# EAGLE design Section (EAGLE 7.6.0)
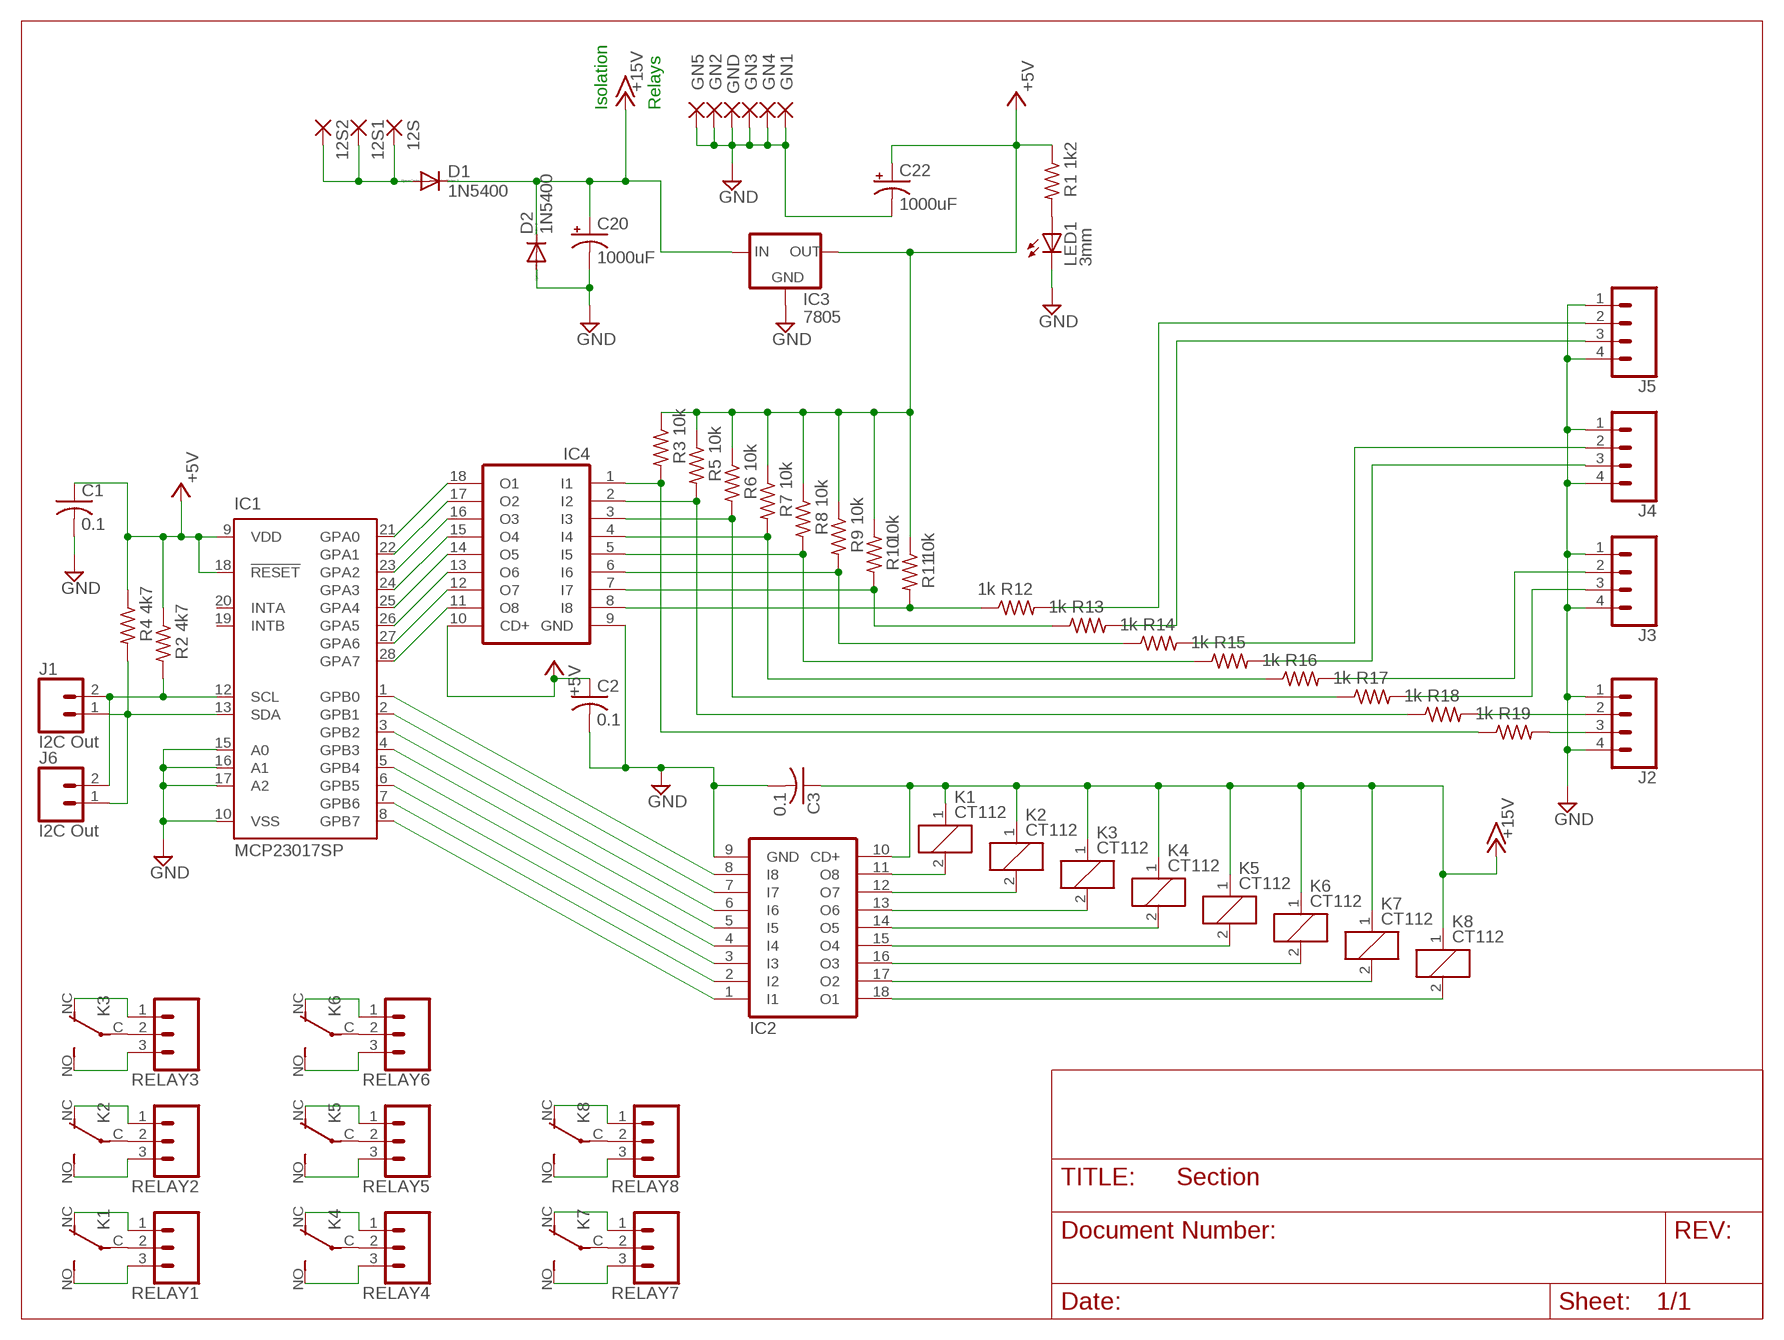
[diagram p0: schematic, sheet 1]

## Parts
12S  WIREPAD3,81/1,1  [3,81/1,1]
12S1  WIREPAD3,81/1,1  [3,81/1,1]
12S2  WIREPAD3,81/1,1  [3,81/1,1]
C1  0.1  C-US025-025X050  [C025-025X050]
C2  0.1  C-US025-025X050  [C025-025X050]
C3  0.1  C-US025-025X050  [C025-025X050]
C20  1000uF  CPOL-USE5-10.5  [E5-10,5]
C22  1000uF  CPOL-USE5-10.5  [E5-10,5]
D1  1N5400  [DO201-15]
D2  1N5400  [DO201-15]
GN1  WIREPAD3,81/1,1  [3,81/1,1]
GN2  WIREPAD3,81/1,1  [3,81/1,1]
GN3  WIREPAD3,81/1,1  [3,81/1,1]
GN4  WIREPAD3,81/1,1  [3,81/1,1]
GN5  WIREPAD3,81/1,1  [3,81/1,1]
GND  WIREPAD3,81/1,1  [3,81/1,1]
IC1  MCP23017SP  [DIL28-3]
IC2  ULN2803A  [DIL18]
IC3  7805  78XXS  [78XXS]
IC4  ULN2803A  [DIL18]
J1  I2C Out  CONN_02PTH3  [1X02_LONGPADS]
J2  CONN_04LONGPADS  [1X04_LONGPADS]
J3  CONN_04LONGPADS  [1X04_LONGPADS]
J4  CONN_04LONGPADS  [1X04_LONGPADS]
J5  CONN_04LONGPADS  [1X04_LONGPADS]
J6  I2C Out  CONN_02PTH3  [1X02_LONGPADS]
K1  CT112  [CT-SLIM]
K2  CT112  [CT-SLIM]
K3  CT112  [CT-SLIM]
K4  CT112  [CT-SLIM]
K5  CT112  [CT-SLIM]
K6  CT112  [CT-SLIM]
K7  CT112  [CT-SLIM]
K8  CT112  [CT-SLIM]
LED1  3mm  LED3MM  [LED3MM]
R1  1k2  R-US_0309/12  [0309/12]
R2  4k7  R-US_0309/12  [0309/12]
R3  10k  R-US_0309/12  [0309/12]
R4  4k7  R-US_0309/12  [0309/12]
R5  10k  R-US_0309/12  [0309/12]
R6  10k  R-US_0309/12  [0309/12]
R7  10k  R-US_0309/12  [0309/12]
R8  10k  R-US_0309/12  [0309/12]
R9  10k  R-US_0309/12  [0309/12]
R10  10k  R-US_0309/12  [0309/12]
R11  10k  R-US_0309/12  [0309/12]
R12  1k  R-US_0309/12  [0309/12]
R13  1k  R-US_0309/12  [0309/12]
R14  1k  R-US_0309/12  [0309/12]
R15  1k  R-US_0309/12  [0309/12]
R16  1k  R-US_0309/12  [0309/12]
R17  1k  R-US_0309/12  [0309/12]
R18  1k  R-US_0309/12  [0309/12]
R19  1k  R-US_0309/12  [0309/12]
RELAY1  CONN_03LONGPADS  [1X03_LONGPADS]
RELAY2  CONN_03LONGPADS  [1X03_LONGPADS]
RELAY3  CONN_03LONGPADS  [1X03_LONGPADS]
RELAY4  CONN_03LONGPADS  [1X03_LONGPADS]
RELAY5  CONN_03LONGPADS  [1X03_LONGPADS]
RELAY6  CONN_03LONGPADS  [1X03_LONGPADS]
RELAY7  CONN_03LONGPADS  [1X03_LONGPADS]
RELAY8  CONN_03LONGPADS  [1X03_LONGPADS]

## Nets
+5V: C1.1 C2.1 C22.+ IC1.9(VDD) IC1.18(!RESET) IC3.OUT IC4.10(CD+) R1.1 R2.1 R3.1 R4.1 R5.1 R6.1 R7.1 R8.1 R9.1 R10.1 R11.1
+12SW: 12S1.1(P) 12S2.1(P) 12S.1(P) D1.A
+15V: C3.1 C20.+ D1.C D2.C IC2.10(CD+) IC3.IN K1.1 K2.1 K3.1 K4.1 K5.1 K6.1 K7.1 K8.1
GND: C1.2 C2.2 C3.2 C20.- C22.- D2.A GN1.1(P) GN2.1(P) GN3.1(P) GN4.1(P) GN5.1(P) GND.1(P) IC1.10(VSS) IC1.15(A0) IC1.16(A1) IC1.17(A2) IC2.9(GND) IC3.GND IC4.9(GND) J2.1 J2.4 J3.1 J3.4 J4.1 J4.4 J5.1 J5.4 LED1.K(C)
N$1: IC2.11(O8) K1.2
N$2: IC1.1(GPB0) IC2.8(I8)
N$3: IC1.2(GPB1) IC2.7(I7)
N$4: IC1.3(GPB2) IC2.6(I6)
N$5: IC1.4(GPB3) IC2.5(I5)
N$6: IC1.5(GPB4) IC2.4(I4)
N$7: IC1.6(GPB5) IC2.3(I3)
N$8: IC1.7(GPB6) IC2.2(I2)
N$9: IC1.8(GPB7) IC2.1(I1)
N$10: IC2.12(O7) K2.2
N$11: IC2.13(O6) K3.2
N$12: IC2.14(O5) K4.2
N$13: IC2.15(O4) K5.2
N$14: IC2.16(O3) K6.2
N$15: IC2.17(O2) K7.2
N$16: IC2.18(O1) K8.2
N$17: IC1.21(GPA0) IC4.18(O1)
N$18: IC1.22(GPA1) IC4.17(O2)
N$19: K1.C(2:P) RELAY1.2
N$20: K2.C(2:P) RELAY2.2
N$21: K3.C(2:P) RELAY3.2
N$22: K5.C(2:P) RELAY5.2
N$23: K4.C(2:P) RELAY4.2
N$24: K6.C(2:P) RELAY6.2
N$25: K7.C(2:P) RELAY7.2
N$26: IC1.23(GPA2) IC4.16(O3)
N$27: K8.C(2:P) RELAY8.2
N$28: IC1.24(GPA3) IC4.15(O4)
N$29: K1.NC(2:O) RELAY1.1
N$30: K1.NO(2:S) RELAY1.3
N$31: K2.NO(2:S) RELAY2.3
N$32: K2.NC(2:O) RELAY2.1
N$33: K3.NO(2:S) RELAY3.3
N$34: IC1.25(GPA4) IC4.14(O5)
N$35: K3.NC(2:O) RELAY3.1
N$36: K6.NC(2:O) RELAY6.1
N$37: K6.NO(2:S) RELAY6.3
N$38: K5.NC(2:O) RELAY5.1
N$39: K5.NO(2:S) RELAY5.3
N$40: K4.NC(2:O) RELAY4.1
N$41: K4.NO(2:S) RELAY4.3
N$42: K7.NO(2:S) RELAY7.3
N$43: K7.NC(2:O) RELAY7.1
N$44: K8.NO(2:S) RELAY8.3
N$45: K8.NC(2:O) RELAY8.1
N$46: LED1.A R1.2
N$47: IC1.26(GPA5) IC4.13(O6)
N$48: IC1.27(GPA6) IC4.12(O7)
N$49: IC1.28(GPA7) IC4.11(O8)
N$50: IC4.8(I8) R11.2 R12.1
N$51: IC4.7(I7) R10.2 R13.1
N$52: IC4.6(I6) R9.2 R14.1
N$53: IC4.5(I5) R8.2 R15.1
N$54: IC4.4(I4) R7.2 R16.1
N$55: IC4.3(I3) R6.2 R17.1
N$56: IC4.2(I2) R5.2 R18.1
N$57: IC4.1(I1) R3.2 R19.1
N$58: J2.3 R19.2
N$59: J2.2 R18.2
N$60: J3.3 R17.2
N$61: J3.2 R16.2
N$62: J4.3 R15.2
N$63: J4.2 R14.2
N$64: J5.3 R13.2
N$65: J5.2 R12.2
SCL: IC1.12(SCL) J1.2 J6.2 R2.2
SDA: IC1.13(SDA) J1.1 J6.1 R4.2
Unconnected: IC1.19(INTB) IC1.20(INTA)

## Notes on the sheet
- Isolation | Relays

## Library data of the parts
12S 12S1 12S2 GN1-GN5 GND = wirepad:WIREPAD: Wire PAD connect wire on PCB
C1-C3 = rcl:C-US: CAPACITOR, American symbol
C20 C22 = rcl:CPOL-US: POLARIZED CAPACITOR, American symbol
D1 D2 = diode:1N5400: DIODE standard rectifier, 3 A, 50 V (Motorola)
IC1 = microchip:MCP23017: http://ww1.microchip.com/downloads/en/DeviceDoc/21952a.pdf Source: http://ww1.microchip.com/downloads/en/DeviceDoc/21952a.pdf; MF: MICROCHIP; MPN: MCP23017-E/SP; OC_FARNELL: 1332088; OC_NEWARK: 31K2959
IC2 IC4 = uln-udn:ULN2803A: DRIVER ARRAY
IC3 = v-reg:78XXS: VOLTAGE REGULATOR
J1 J6 = SparkFun-Connectors:CONN_02: Multi connection point. Often used as Generic Header-pin footprint for 0.1 inch spaced/style header connections On any of the 0.1 inch spaced packages, you can populate with these: Break Away Headers - Straight <https://www.sparkfun.com/products/116> (PRT-00116) Break Away Male Headers - Right Angle <https://www.sparkfun.com/products/553> (PRT-00553) Female Headers <https://www.sparkfun.com/products/115> (PRT-00115) Break Away Headers - Machine Pin <https://www.sparkfun.com/products/117> (PRT-00117) Break Away Female Headers - Swiss Machine Pin <https://www.sparkfun.com/products/743> (PRT-00743) For SCREWTERMINALS and SPRING TERMINALS visit here: Screw Terimnals on SparkFun.com <https://www.sparkfun.com/search/results?term=Screw+Terminals> (5mm/3.5mm/2.54mm spacing) This device is also useful as a general connection point to wire up your design to another part of your project. Our various solder wires solder well into these plated through hole pads. Hook-Up Wire - Assortment (Stranded, 22 AWG) <https://www.sparkfun.com/products/11375> (PRT-11375) Hook-Up Wire - Assortment (Solid Core, 22 AWG) <https://www.sparkfun.com/products/11367> (PRT-11367) View the entire wire category on our website here <https://www.sparkfun.com/categories/141> Special notes: Molex polarized connector foot print use with: PRT-08233 with associated crimp pins and housings. 2.54_SCREWTERM for use with PRT-10571. 3.5mm Screw Terminal footprints for PRT-08084 5mm Screw Terminal footprints for use with PRT-08432
J2-J5 = SparkFun-Connectors:CONN_04: Multi connection point. Often used as Generic Header-pin footprint for 0.1 inch spaced/style header connections On any of the 0.1 inch spaced packages, you can populate with these: Break Away Headers - Straight <https://www.sparkfun.com/products/116> (PRT-00116) Break Away Male Headers - Right Angle <https://www.sparkfun.com/products/553> (PRT-00553) Female Headers <https://www.sparkfun.com/products/115> (PRT-00115) Break Away Headers - Machine Pin <https://www.sparkfun.com/products/117> (PRT-00117) Break Away Female Headers - Swiss Machine Pin <https://www.sparkfun.com/products/743> (PRT-00743) For SCREWTERMINALS and SPRING TERMINALS visit here: Screw Terimnals on SparkFun.com <https://www.sparkfun.com/search/results?term=Screw+Terminals> (5mm/3.5mm/2.54mm spacing) This device is also useful as a general connection point to wire up your design to another part of your project. Our various solder wires solder well into these plated through hole pads. Hook-Up Wire - Assortment (Stranded, 22 AWG) <https://www.sparkfun.com/products/11375> (PRT-11375) Hook-Up Wire - Assortment (Solid Core, 22 AWG) <https://www.sparkfun.com/products/11367> (PRT-11367) View the entire wire category on our website here <https://www.sparkfun.com/categories/141> Special notes: Molex polarized connector foot print use with SKU : PRT-08231 with associated crimp pins and housings. 1MM SMD Version SKU: PRT-10208; PROD_ID: CONN-09696
K1-K8 = relay:CT112: ULTRA SMALL AUTOMOTIVE RELAY NAiS Slim 1c type en_ds_61205_0000.pdf; OC_FARNELL: unknown; OC_NEWARK: unknown
LED1 = led:LED: LED OSRAM: - CHIPLED LG R971, LG N971, LY N971, LG Q971, LY Q971, LO R971, LY R971 LH N974, LH R974 LS Q976, LO Q976, LY Q976 LO Q996 - Hyper CHIPLED LW Q18S LB Q993, LB Q99A, LB R99A - SideLED LS A670, LO A670, LY A670, LG A670, LP A670 LB A673, LV A673, LT A673, LW A673 LH A674 LY A675 LS A676, LA A676, LO A676, LY A676, LW A676 LS A679, LY A679, LG A679 - Hyper Micro SIDELED® LS Y876, LA Y876, LO Y876, LY Y876 LT Y87S - SmartLED LW L88C, LW L88S LB L89C, LB L89S, LG L890 LS L89K, LO L89K, LY L89K LS L896, LA L896, LO L896, LY L896 - TOPLED LS T670, LO T670, LY T670, LG T670, LP T670 LSG T670, LSP T670, LSY T670, LOP T670, LYG T670 LG T671, LOG T671, LSG T671 LB T673, LV T673, LT T673, LW T673 LH T674 LS T676, LA T676, LO T676, LY T676, LB T676, LH T676, LSB T676, LW T676 LB T67C, LV T67C, LT T67C, LS T67K, LO T67K, LY T67K, LW E67C LS E67B, LA E67B, LO E67B, LY E67B, LB E67C, LV E67C, LT E67C LW T67C LS T679, LY T679, LG T679 LS T770, LO T770, LY T770, LG T770, LP T770 LB T773, LV T773, LT T773, LW T773 LH T774 LS E675, LA E675, LY E675, LS T675 LS T776, LA T776, LO T776, LY T776, LB T776 LHGB T686 LT T68C, LB T68C - Hyper Mini TOPLED® LB M676 - Mini TOPLED Santana® LG M470 LS M47K, LO M47K, LY M47K Source: http://www.osram.convergy.de LUXEON: - LUMILED® LXK2-PW12-R00, LXK2-PW12-S00, LXK2-PW14-U00, LXK2-PW14-V00 LXK2-PM12-R00, LXK2-PM12-S00, LXK2-PM14-U00 LXK2-PE12-Q00, LXK2-PE12-R00, LXK2-PE12-S00, LXK2-PE14-T00, LXK2-PE14-U00 LXK2-PB12-K00, LXK2-PB12-L00, LXK2-PB12-M00, LXK2-PB14-N00, LXK2-PB14-P00, LXK2-PB14-Q00 LXK2-PR12-L00, LXK2-PR12-M00, LXK2-PR14-Q00, LXK2-PR14-R00 LXK2-PD12-Q00, LXK2-PD12-R00, LXK2-PD12-S00 LXK2-PH12-R00, LXK2-PH12-S00 LXK2-PL12-P00, LXK2-PL12-Q00, LXK2-PL12-R00 Source: www.luxeon.com KINGBRIGHT: KA-3528ASYC Source: www.kingbright.com
R1-R19 = rcl:R-US_: RESISTOR, American symbol
RELAY1-RELAY8 = SparkFun-Connectors:CONN_03: Multi connection point. Often used as Generic Header-pin footprint for 0.1 inch spaced/style header connections On any of the 0.1 inch spaced packages, you can populate with these: Break Away Headers - Straight <https://www.sparkfun.com/products/116> (PRT-00116) Break Away Male Headers - Right Angle <https://www.sparkfun.com/products/553> (PRT-00553) Female Headers <https://www.sparkfun.com/products/115> (PRT-00115) Break Away Headers - Machine Pin <https://www.sparkfun.com/products/117> (PRT-00117) Break Away Female Headers - Swiss Machine Pin <https://www.sparkfun.com/products/743> (PRT-00743) Stackable Header - 3 Pin (Female, 0.1") <https://www.sparkfun.com/products/13875> (PRT-13875) For SCREWTERMINALS and SPRING TERMINALS visit here: Screw Terimnals on SparkFun.com <https://www.sparkfun.com/search/results?term=Screw+Terminals> (5mm/3.5mm/2.54mm spacing) This device is also useful as a general connection point to wire up your design to another part of your project. Our various solder wires solder well into these plated through hole pads. Hook-Up Wire - Assortment (Stranded, 22 AWG) <https://www.sparkfun.com/products/11375> (PRT-11375) Hook-Up Wire - Assortment (Solid Core, 22 AWG) <https://www.sparkfun.com/products/11367> (PRT-11367) View the entire wire category on our website here <https://www.sparkfun.com/categories/141> Special notes: Molex polarized connector foot print use with SKU : PRT-08232 with associated crimp pins and housings.

## Module MOTOR_CONTROLLER
Ports: 

### Library data of the parts

## Board
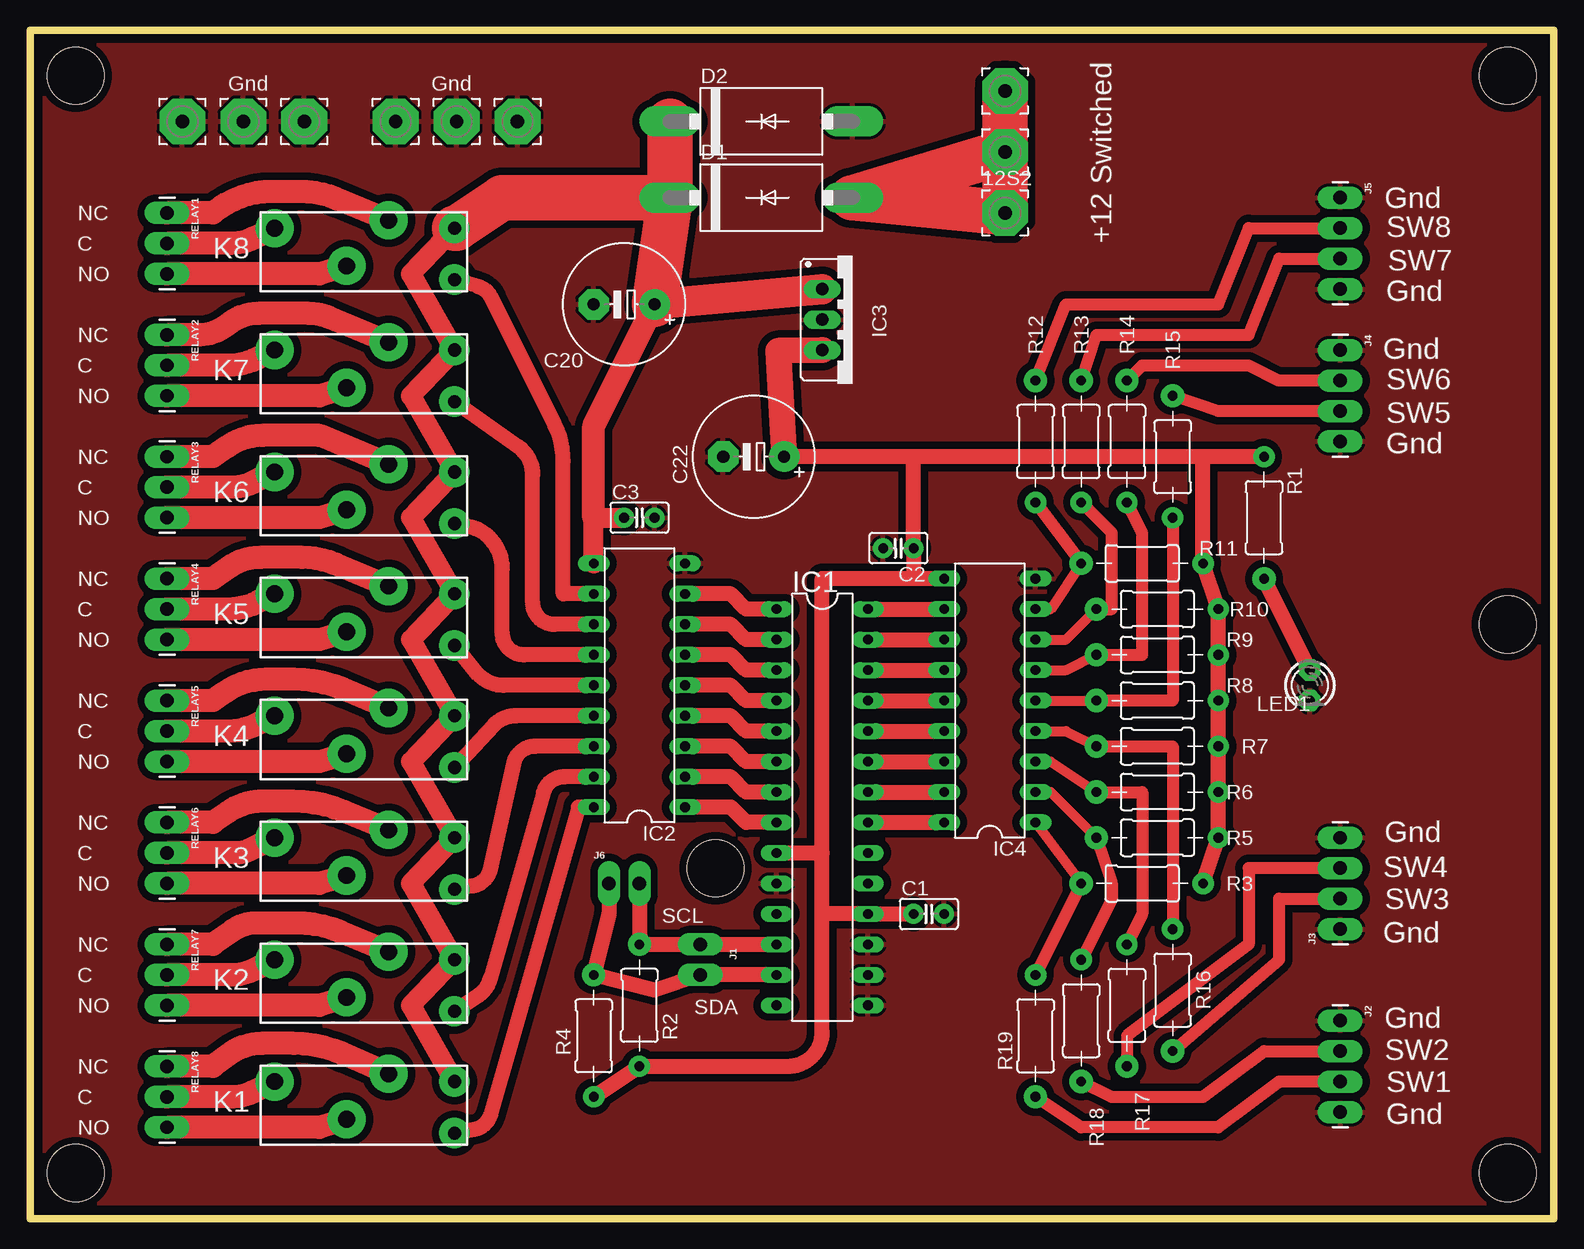
[diagram p1: board, top side]
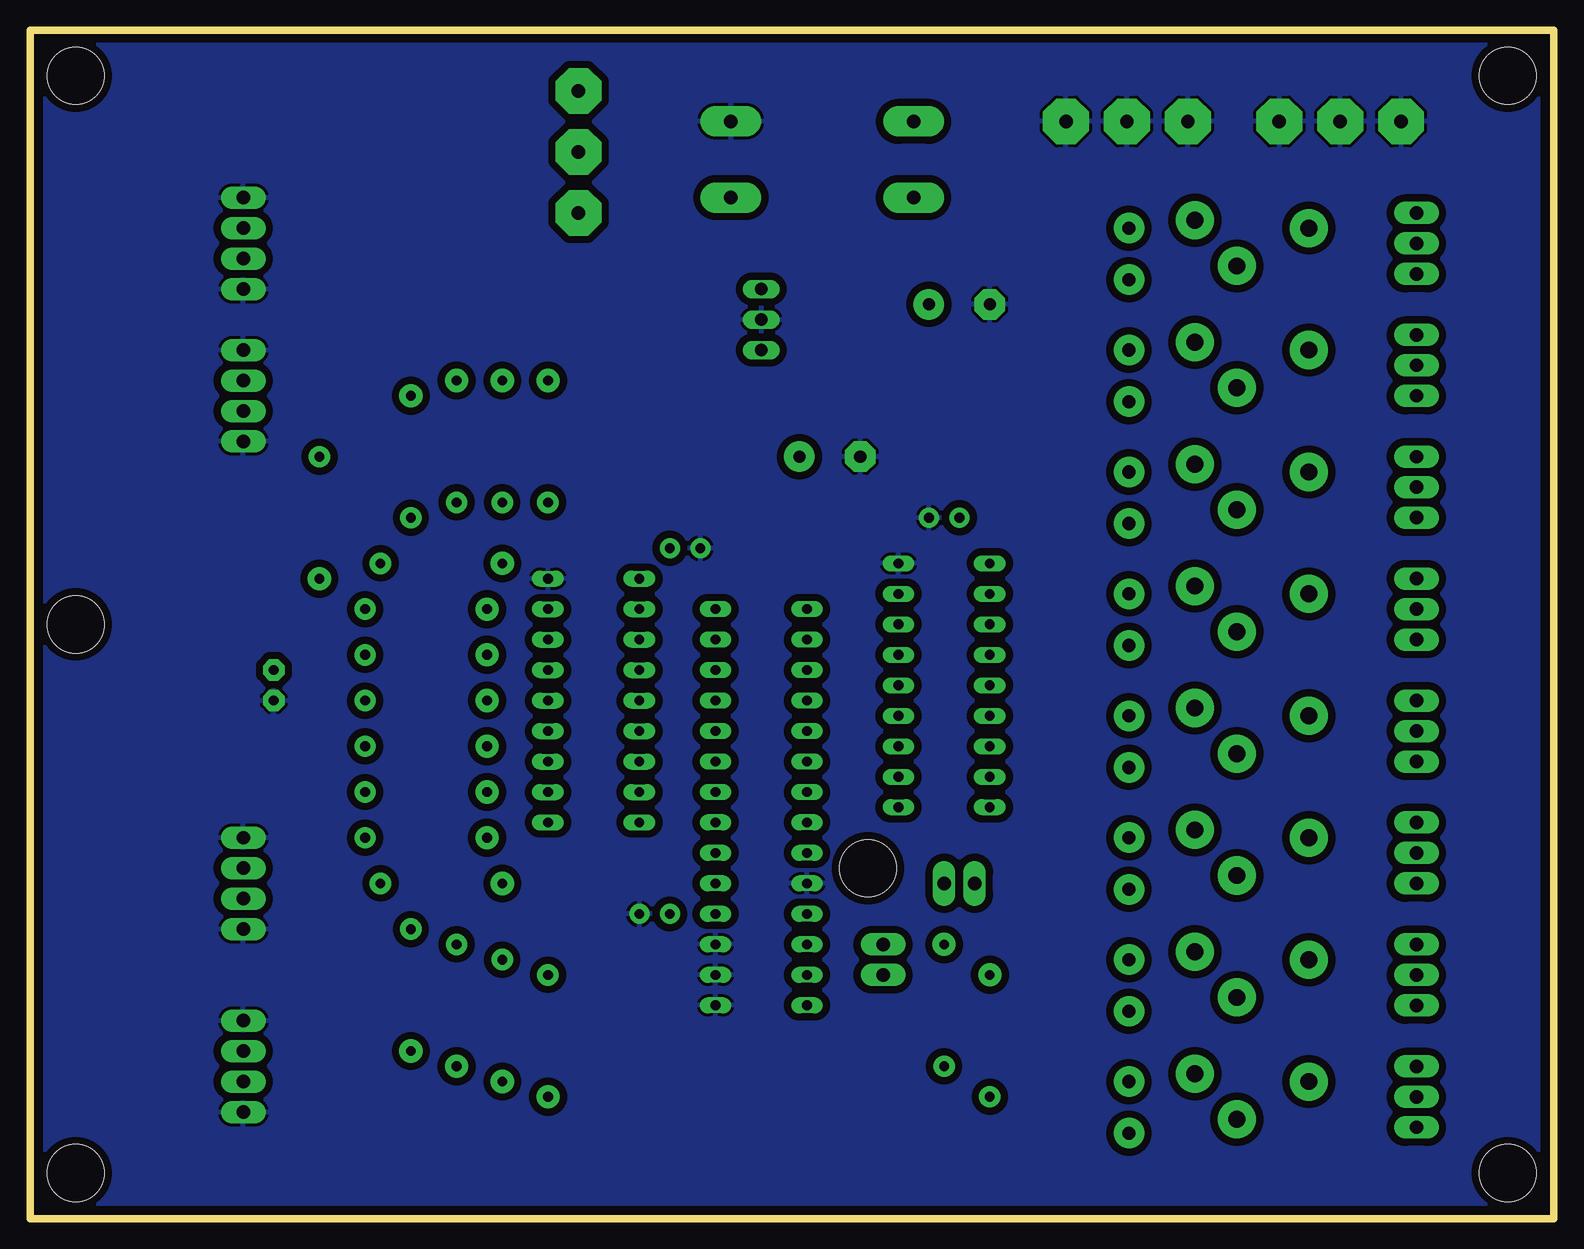
[diagram p2: board, bottom side, seen from below]

Size 127 x 99.06 mm. Coordinates in mm from the lower left corner, seen from the top.
Outline: 0,0 127,0 127,99.06 0,99.06 0,0
Copper layers (1*16): Top 0.035mm / dielectric 1.5mm / Bottom 0.035mm
Design rules "default *": minimum track width 16mil, minimum drill 0.35mm, track to track 6mil, track to pad 6mil, pad to pad 6mil, via to via 6mil, smd to smd 6mil, copper to edge 8mil, drill to drill 6mil, minimum pad ring 10mil, minimum via ring 8mil, stop-mask expansion 4mil, vias tented up to drill 0mil, thermal gap 10mil
Holes 4.76 mm at 3.81,3.81 123.19,3.81 3.81,95.25 123.19,95.25 123.19,49.53 57.15,29.21

### Footprints (pad centres in the part's own frame; a part is rotated, then mirrored left to right if it is on the bottom)
3,81/1,1 = drill 1.118 pad 3.81 octagon: 1 0,0
C025-025X050 = drill 0.813 pad 1.676: 1 -1.27,0; 2 1.27,0
E5-10,5 = drill 1.016 pad 2.54: + -2.54,0 | drill 1.016 pad 2.54 octagon: - 2.54,0
DO201-15 = drill 1.118 pad 2.54 long: A 7.62,0; C -7.62,0
DIL28-3 = drill 0.813 long: 1 -16.51,-3.81; 2 -13.97,-3.81; 3 -11.43,-3.81; 4 -8.89,-3.81; 5 -6.35,-3.81; 6 -3.81,-3.81; 7 -1.27,-3.81; 8 1.27,-3.81; 9 3.81,-3.81; 10 6.35,-3.81; 11 8.89,-3.81; 12 11.43,-3.81; 13 13.97,-3.81; 14 16.51,-3.81; 15 16.51,3.81; 16 13.97,3.81; 17 11.43,3.81; 18 8.89,3.81; 19 6.35,3.81; 20 3.81,3.81; 21 1.27,3.81; 22 -1.27,3.81; 23 -3.81,3.81; 24 -6.35,3.81; 25 -8.89,3.81; 26 -11.43,3.81; 27 -13.97,3.81; 28 -16.51,3.81
DIL18 = drill 0.813 long: 1 -10.16,-3.81; 2 -7.62,-3.81; 3 -5.08,-3.81; 4 -2.54,-3.81; 5 0,-3.81; 6 2.54,-3.81; 7 5.08,-3.81; 8 7.62,-3.81; 9 10.16,-3.81; 10 10.16,3.81; 11 7.62,3.81; 12 5.08,3.81; 13 2.54,3.81; 14 0,3.81; 15 -2.54,3.81; 16 -5.08,3.81; 17 -7.62,3.81; 18 -10.16,3.81
78XXS = drill 1.016 long: GND 0,-2.54; IN -2.54,-2.54; OUT 2.54,-2.54
1X02_LONGPADS = drill 1.118 pad 1.88 long: 1 0,0; 2 2.54,0
1X04_LONGPADS = drill 1.118 pad 1.88 long: 1 0,0; 2 2.54,0; 3 5.08,0; 4 7.62,0
CT-SLIM = drill 1.1 pad 2.54: 1 -7.45,0; 2 -7.45,4.3 | drill 1.4 pad 3.175: C 7.55,0; NC -1.95,-0.65; NO 1.55,3.15
LED3MM = drill 0.813 pad 1.778 octagon: A -1.27,0; K 1.27,0
0309/12 = drill 0.813 pad 1.778: 1 -5.08,0 | drill 0.813 pad 1.93: 2 5.08,0
1X03_LONGPADS = drill 1.118 pad 1.88 long: 1 0,0; 2 2.54,0; 3 5.08,0

### Placement (x,y rotation side)
12S  81.28,88.9 180 top
12S1  81.28,93.98 0 top
12S2  81.28,83.82 0 top
C1  74.93,25.4 0 top
C2  72.39,55.88 180 top
C3  50.8,58.42 0 top
C20  49.53,76.2 180 top
C22  60.33,63.5 180 top
D1  60.96,85.09 0 top
D2  60.96,91.44 0 top
GN1  30.48,91.44 0 top
GN2  17.78,91.44 0 top
GN3  35.56,91.44 180 top
GN4  22.86,91.44 0 top
GN5  40.64,91.44 0 top
GND  12.7,91.44 0 top
IC1  66.04,34.29 270 top
IC2  50.8,44.45 90 top
IC3  68.58,74.93 270 top
IC4  80.01,43.18 90 top
J1  55.88,20.32 90 top
J2  109.22,16.51 270 top
J3  109.22,24.13 90 top
J4  109.22,72.39 270 top
J5  109.22,85.09 270 top
J6  48.26,27.94 0 top
K1  27.94,82.55 180 top
K2  27.94,72.39 180 top
K3  27.94,62.23 180 top
K4  27.94,52.07 180 top
K5  27.94,41.91 180 top
K6  27.94,31.75 180 top
K7  27.94,21.59 180 top
K8  27.94,11.43 180 top
LED1  106.68,44.45 270 top
R1  102.87,58.42 270 top
R2  50.8,17.78 90 top
R3  92.71,27.94 180 top
R4  46.99,15.24 90 top
R5  93.98,31.75 180 top
R6  93.98,35.56 180 top
R7  93.98,39.37 180 top
R8  93.98,43.18 180 top
R9  93.98,46.99 180 top
R10  93.98,50.8 180 top
R11  92.71,54.61 180 top
R12  83.82,64.77 90 top
R13  87.63,64.77 90 top
R14  91.44,64.77 90 top
R15  95.25,63.5 90 top
R16  95.25,19.05 270 top
R17  91.44,17.78 270 top
R18  87.63,16.51 270 top
R19  83.82,15.24 270 top
RELAY1  11.43,83.82 270 top
RELAY2  11.43,73.66 270 top
RELAY3  11.43,63.5 270 top
RELAY4  11.43,53.34 270 top
RELAY5  11.43,43.18 270 top
RELAY6  11.43,33.02 270 top
RELAY7  11.43,22.86 270 top
RELAY8  11.43,12.7 270 top

### Tracks (layer width: path | path; a pad name or v marks a point on that pad's centre or on a via)
+5V
  Top 1.27: R4.1 R2.1 63.2,12.7 arc90 66.04,15.54 66.04,25.4 | 66.04,25.4 66.04,30.48 | 66.04,30.48 66.04,53.34 73.66,53.34 | C1.1 IC1.18 66.04,25.4 | IC1.9 66.04,30.48 | IC4.10 73.66,53.34 | 73.66,53.34 C2.1 73.66,63.5 | 62.38,72.33 62.23,72.39 IC3.OUT | R3.1 R5.1 R6.1 R7.1 R8.1 R9.1 R10.1 R11.1 97.79,63.5 | 97.79,63.5 73.66,63.5 | 73.66,63.5 C22.+ | R1.1 97.79,63.5
  Top 2.184: IC3.OUT 62.38,72.33 C22.+
+12SW
  Top 3.81: 12S1.1 12S.1 | 12S.1 D1.A 12S2.1 12S.1
+15V
  Top 1.676: IC2.10 46.99,58.42 C3.1 | K1.1 31.75,78.74 K2.1 31.75,68.58 K3.1 31.75,58.42 K4.1 31.75,48.26 K5.1 31.75,38.1 K6.1 31.75,27.94 K7.1 31.75,17.78 K8.1
  Top 1.93: 46.99,58.42 46.99,66.04 C20.+
  Top 2.54: IC3.IN C20.+
  Top 3.81: D1.C 39.37,85.09 35.56,82.55 K1.1 | C20.+ D1.C | D1.C D2.C
GND
  pour Bottom (isolate 0.61): 1.27,97.79 125.73,97.79 125.73,1.27 1.27,1.27
  pour Top (isolate 0.61): 1.27,97.79 125.73,97.79 125.73,93.98 125.73,1.27 1.27,1.27
N$1
  Top 1.27: IC2.11 44.45,52.07 44.45,63.16 arc27 43.73,66.21 38.45,76.77 arc47 37.34,77.69 K1.2
N$2
  Top 1.27: IC1.1 59.69,50.8 58.42,52.07 IC2.8
N$3
  Top 1.27: IC1.2 59.69,48.26 58.42,49.53 IC2.7
N$4
  Top 1.27: IC1.3 59.69,45.72 58.42,46.99 IC2.6
N$5
  Top 1.27: IC1.4 59.69,43.18 58.42,44.45 IC2.5
N$6
  Top 1.27: IC1.5 59.69,40.64 58.42,41.91 IC2.4
N$7
  Top 1.27: IC1.6 59.69,38.1 58.42,39.37 IC2.3
N$8
  Top 1.27: IC1.7 59.69,35.56 58.42,36.83 IC2.2
N$9
  Top 1.27: IC1.8 59.69,33.02 58.42,34.29 IC2.1
N$10
  Top 1.27: IC2.12 43.71,49.53 arc-90 41.91,51.33 41.91,62.03 arc55 40.7,64.35 K2.2
N$11
  Top 1.27: IC2.13 41.17,46.99 arc-90 39.37,48.79 39.37,54.19 arc79 36.47,57.72 K3.2
N$12
  Top 1.27: IC2.14 39.45,44.45 arc-51 37.25,45.49 K4.2
N$13
  Top 1.27: IC2.15 40.48,41.91 arc47 38.62,41.09 K5.2
N$14
  Top 1.27: IC2.16 42.08,39.37 arc77 40.33,37.96 38.36,29.11 arc-67 36.92,27.73 K6.2
N$15
  Top 1.27: IC2.17 44.53,36.83 arc74 42.81,35.53 38.39,20.07 arc-41 37.21,18.47 K7.2
N$16
  Top 1.27: IC2.18 45.72,34.29 38.41,8.7 arc-64 37,7.42 K8.2
N$17
  Top 1.27: IC1.21 IC4.18
N$18
  Top 1.27: IC1.22 IC4.17
N$19
  Top 1.93: K1.C 18.73,81.74 arc-26 16.73,81.28 RELAY1.2
N$20
  Top 1.93: K2.C 18.96,71.69 arc-26 16.47,71.12 RELAY2.2
N$21
  Top 1.93: K3.C 18.61,61.37 arc-26 16.86,60.96 RELAY3.2
N$22
  Top 1.93: K5.C 18.86,41.17 arc-26 16.57,40.64 RELAY5.2
N$23
  Top 1.93: K4.C 18.96,51.37 arc-26 16.47,50.8 RELAY4.2
N$24
  Top 1.93: K6.C 18.37,30.77 arc-26 17.13,30.48 RELAY6.2
N$25
  Top 1.93: K7.C 18.61,20.73 arc-26 16.86,20.32 RELAY7.2
N$26
  Top 1.27: IC1.23 IC4.16
N$27
  Top 1.93: K8.C 18.61,10.56 arc-26 16.86,10.16 RELAY8.2
N$28
  Top 1.27: IC1.24 IC4.15
N$29
  Top 1.93: K1.NC 25.58,85 arc23 22.56,85.6 20.09,85.6 arc35 15.89,84.28 15.24,83.82 RELAY1.1
N$30
  Top 1.93: K1.NO 24.13,78.74 RELAY1.3
N$31
  Top 1.93: K2.NO 24.13,68.58 RELAY2.3
N$32
  Top 1.93: K2.NC 24.96,75.09 arc23 23.23,75.44 19.03,75.44 arc35 16.75,74.72 16.17,74.31 arc-35 14.11,73.66 RELAY2.1
N$33
  Top 1.93: K3.NO 24.13,58.42 RELAY3.3
N$34
  Top 1.27: IC1.25 IC4.14
N$35
  Top 1.93: K3.NC 24.13,65.28 19.36,65.28 arc35 16.49,64.37 15.24,63.5 RELAY3.1
N$36
  Top 1.93: K6.NC 26.22,33.93 arc23 21.87,34.8 19.36,34.8 arc35 16.49,33.89 15.24,33.02 RELAY6.1
N$37
  Top 1.93: K6.NO 24.13,27.94 RELAY6.3
N$38
  Top 1.93: K5.NC 26.15,44.12 arc23 21.94,44.96 19.71,44.96 arc35 16.2,43.85 15.24,43.18 RELAY5.1
N$39
  Top 1.93: K5.NO 24.13,38.1 RELAY5.3
N$40
  Top 1.93: K4.NC 25.48,54.56 arc23 22.67,55.12 19.2,55.12 arc35 16.62,54.3 15.24,53.34 RELAY4.1
N$41
  Top 1.93: K4.NO 24.13,48.26 RELAY4.3
N$42
  Top 1.93: K7.NO 24.13,17.78 RELAY7.3
N$43
  Top 1.93: K7.NC 25.86,23.92 arc23 22.25,24.64 18.82,24.64 arc35 16.93,24.04 15.24,22.86 RELAY7.1
N$44
  Top 1.93: K8.NO 24.13,7.62 RELAY8.3
N$45
  Top 1.93: K8.NC 26.1,13.74 arc24 21.98,14.61 19.32,14.61 arc37 16.55,13.68 15.24,12.7 RELAY8.1
N$46
  Top 1.27: R1.2 LED1.A
N$47
  Top 1.27: IC1.26 IC4.13
N$48
  Top 1.27: IC1.27 IC4.12
N$49
  Top 1.27: IC1.28 IC4.11
N$50
  Top 0.813: IC4.8 85.09,50.8 R11.2
  Top 1.016: R12.1 R11.2
N$51
  Top 0.813: IC4.7 86.36,48.26 R10.2
  Top 1.016: R10.2 90.17,50.8 90.17,57.15 R13.1
N$52
  Top 0.813: IC4.6 86.36,45.72 R9.2
  Top 1.016: R9.2 92.71,46.99 92.71,57.15 R14.1
N$53
  Top 0.813: IC4.5 R8.2
  Top 1.016: R15.1 95.25,43.18 R8.2
N$54
  Top 0.813: IC4.4 86.36,40.64 R7.2
  Top 1.016: R7.2 95.25,39.37 R16.1
N$55
  Top 0.813: IC4.3 85.09,38.1 R6.2
  Top 1.016: R6.2 92.71,35.56 92.71,25.4 R17.1
N$56
  Top 0.813: IC4.2 85.09,35.56 R5.2
  Top 1.016: R5.2 90.17,27.94 90.17,26.67 R18.1
N$57
  Top 0.813: IC4.1 R3.2
  Top 1.016: R3.2 R19.1
N$58
  Top 1.016: J2.3 104.14,11.43 99.06,7.62 87.63,7.62 R19.2
N$59
  Top 1.016: R18.2 90.17,10.16 97.79,10.16 102.87,13.97 J2.2
N$60
  Top 1.016: J3.3 101.6,29.21 101.6,22.86 91.44,15.24 R17.2
N$61
  Top 1.016: R16.2 104.14,21.59 104.14,26.67 J3.2
N$62
  Top 1.016: J4.3 99.06,67.31 R15.2
N$63
  Top 1.016: R14.2 92.71,71.12 101.6,71.12 104.14,69.85 J4.2
N$64
  Top 1.016: R13.2 88.9,73.66 101.6,73.66 104.14,80.01 J5.3
N$65
  Top 1.016: R12.2 86.36,76.2 99.06,76.2 101.6,82.55 J5.2
SCL
  Top 1.27: IC1.12 J1.2 R2.2 J6.2
SDA
  Top 1.27: IC1.13 J1.1 52.07,19.05 R4.2 48.26,25.4 J6.1

### Text on the board
tPlace: Gnd | Gnd | Gnd | NC | SW8 | C | +12 Switched | K8 | SW7 | NO | Gnd | NC | Gnd | C | K7 | SW6 | NO | SW5 | Gnd | NC | C | K6 | NO | NC | C | K5 | NO | NC | C | K4 | NO | NC | Gnd | C | K3 | SW4 | NO | SCL | SW3 | Gnd | NC | C | K2 | NO | SDA | Gnd | SW2 | NC | SW1 | C | K1 | Gnd | NO